# Altium schematic sheet CONNECTORS.SchDoc
size A; SheetNumber: 6; SheetTotal: 9
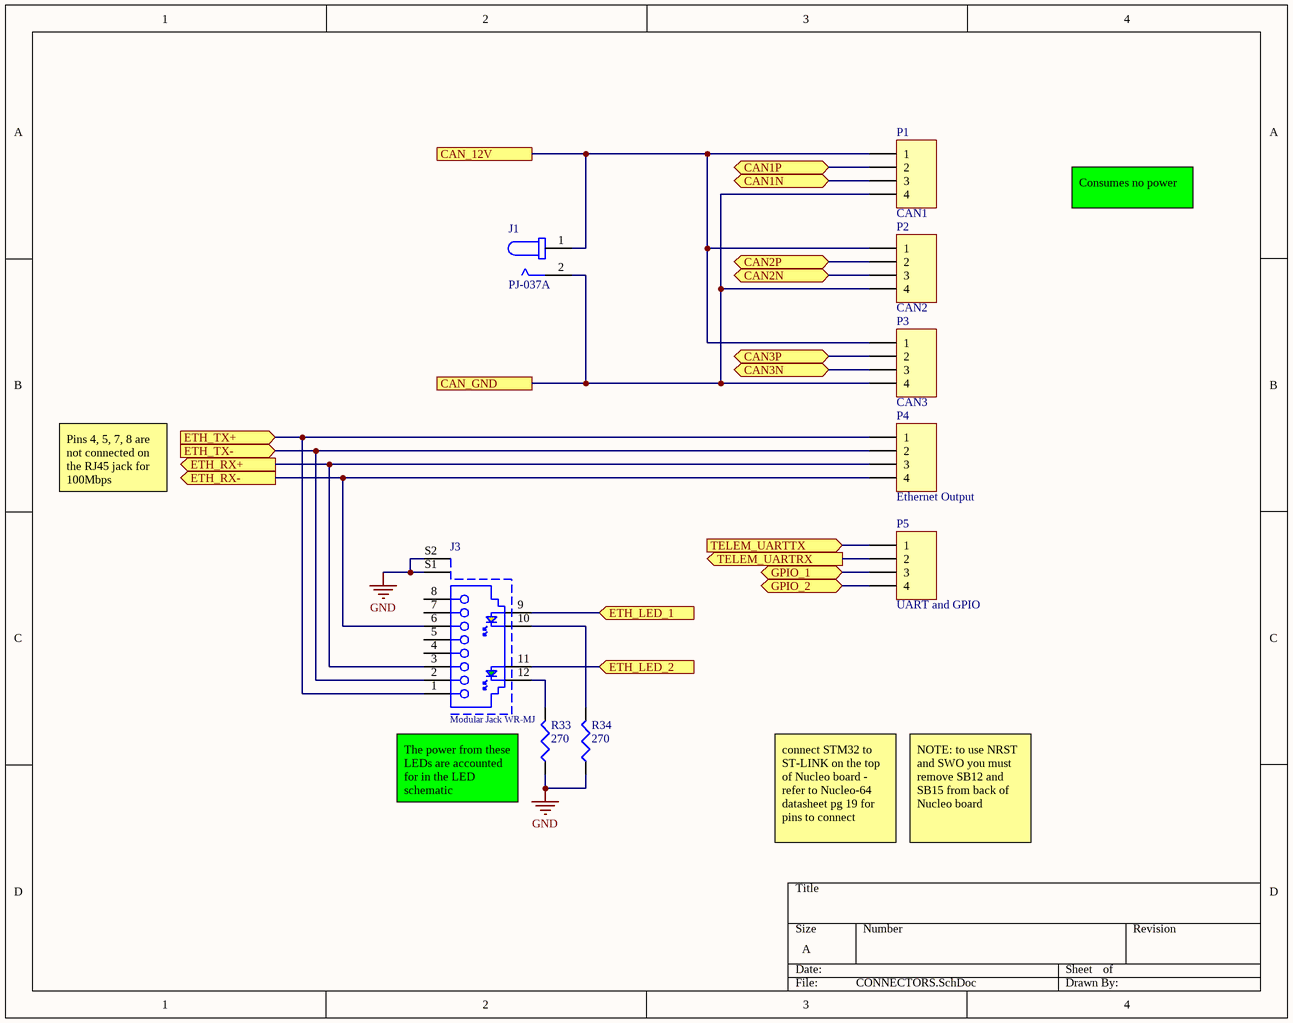
[diagram p0: CONNECTORS.SchDoc]

## Parts
J1  PJ-037A  [CUI_PJ-037A]
J3  Modular Jack WR-MJ  [615008137421]
P1  CAN1  [HDR1X4]
P2  CAN2  [HDR1X4]
P3  CAN3  [HDR1X4]
P4  Ethernet Output  [HDR1X4]
P5  UART and GPIO  [HDR1X4]
R33  270  [J1-0603]
R34  270  [J1-0603]

## Ports
CAN1N (bidir), CAN1P (bidir), CAN2N (bidir), CAN2P (bidir), CAN3N (bidir), CAN3P (bidir), CAN_12V, CAN_GND, ETH_LED_1 (in), ETH_LED_2 (in), ETH_RX+ (out), ETH_RX- (out), ETH_TX+ (in), ETH_TX- (in), GPIO_1 (bidir), GPIO_2 (bidir), TELEM_UARTRX (out), TELEM_UARTTX (in)

## Nets
GND: J3.S1 J3.S2 R33.1 R34.1
CAN1N: P1.3 ; port CAN1N
CAN1P: P1.2 ; port CAN1P
CAN2N: P2.3 ; port CAN2N
CAN2P: P2.2 ; port CAN2P
CAN3N: P3.3 ; port CAN3N
CAN3P: P3.2 ; port CAN3P
CAN_12V: J1.1 P1.1 P2.1 P3.1 ; port CAN_12V
CAN_GND: J1.2 P1.4 P2.4 P3.4 ; port CAN_GND
ETH_LED_1: J3.9 ; port ETH_LED_1
ETH_LED_2: J3.11 ; port ETH_LED_2
ETH_RX+: J3.3 P4.3 ; port ETH_RX+
ETH_RX-: J3.6 P4.4 ; port ETH_RX-
ETH_TX+: J3.1 P4.1 ; port ETH_TX+
ETH_TX-: J3.2 P4.2 ; port ETH_TX-
GPIO_1: P5.3 ; port GPIO_1
GPIO_2: P5.4 ; port GPIO_2
TELEM_UARTRX: P5.2 ; port TELEM_UARTRX
TELEM_UARTTX: P5.1 ; port TELEM_UARTTX
NetJ3_10: J3.10 R34.2
NetJ3_12: J3.12 R33.2

Not connected (* = marked no-connect by the designer): J3 4 5 7 8

## Notes on the sheet
- Consumes no power
- Pins 4, 5, 7, 8 are not connected on the RJ45 jack for 100Mbps
- The power from these LEDs are accounted for in the LED schematic
- connect STM32 to ST-LINK on the top of Nucleo board - refer to Nucleo-64 datasheet pg 19 for pins to connect
- NOTE: to use NRST and SWO you must remove SB12 and SB15 from back of Nucleo board

## Library data of the parts
J1 = PJ-037A: 2.0 x 6.5 mm, 2.5 A, Horizontal, Through Hole, Dc Power Jack Connector / VEL12US120-US-JA is a good power source; MF: CUI Devices; Price: None; Package: None; MP: PJ-037A; Value: *; Availability: Unavailable; SnapEDA_Link: https://www.snapeda.com/parts/PJ-037A/CUI%20Devices/view-part/493699/?ref=snap; CUI_purchase_URL: https://www.cuidevices.com/product/interconnect/connectors/dc-power-connectors/jacks/pj-037a?utm_source=snapeda.com&utm_medium=referral&utm_campaign=snapedaBOM
J3 = CMP-1502-01697-1: Modular Jack WR-MJ, Tab Up, Shielded, with LED and EMI Panel Finger, Horizontal Entry, THT, 8P8C; Manufacturer: Wurth Elektronik; Compliance: Leadfree/RoHS; Withstanding Voltage: 1000VAC; Port: 1x1; Contact Resistance: 20mOhm; Rated Current: 1.5A; Working Voltage: 120VAC; Manufacturer URL: http://www.we-online.de; Mounting Technology: THT; Entrance: Horizontal; Datasheet URL: https://katalog.we-online.de/em/datasheet/615008137421.pdf; Packaging: Tray; Package Reference: 615008137421; Publisher: WurthElektronik; Operating Temperature: -40to85degC; Part Number: 615008137421; Pin Number: 8P8C
P1-P5 = Header 4: Header, 4-Pin; LatestRevisionDate: 17-Jul-2002; LatestRevisionNote: Re-released for DXP Platform.; Publisher: Altium Limited
R33 R34 = Res3: Resistor; Published: 8-Jun-2000; LatestRevisionDate: 29-May-2009; LatestRevisionNote: IPC-7351 Footprint Added.; PackageReference: J1-0603; Publisher: Altium Limited; PackageDescription: Chip Resistor; Value: 270